# EAGLE design 232_compass (EAGLE 9.6.2)
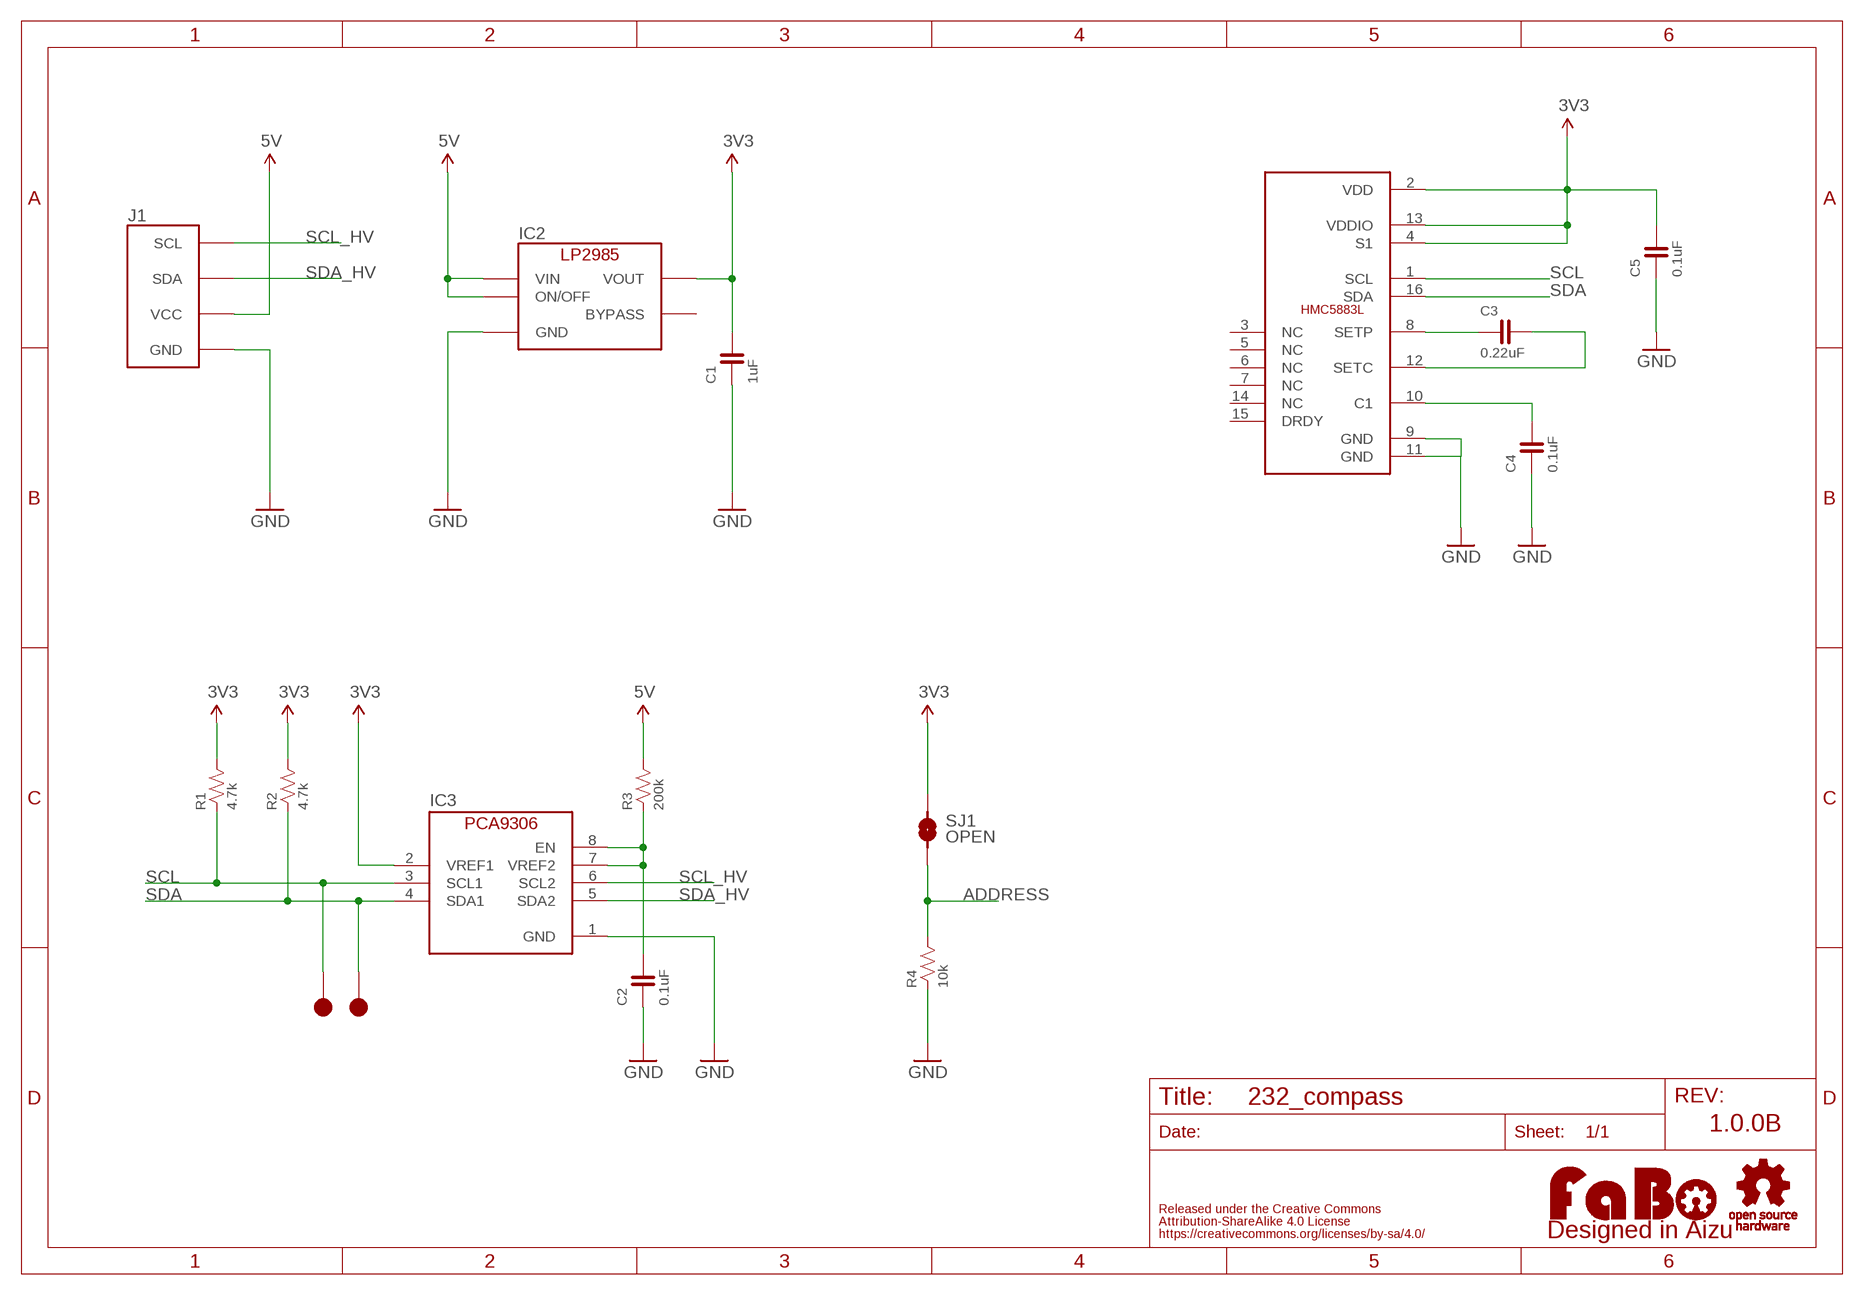
[diagram p0: schematic, sheet 1]

## Parts
C1  1uF  CAPACITOR-0603  [0603]
C2  0.1uF  CAPACITOR-0603  [0603]
C3  0.22uF  CAPACITOR-0603  [0603]
C4  0.1uF  CAPACITOR-0603  [0603]
C5  0.1uF  CAPACITOR-0603  [0603]
HMC5883L  HONEYWELL-HMC5883L  [HONEYWELL-HMC5883L]
IC2  LP2985-33DBV  [SOT-23-5]
IC3  PCA9306GM  [XQFN8]
J1  FABO_BRICK_I2C  [FABO_BRICK_I2C]
LOGO1  LOGO_FABO-M  [LOGO_FABO_M]
R1  4.7k  RESISTOR-0603  [0603]
R2  4.7k  RESISTOR-0603  [0603]
R3  200k  RESISTOR-0603  [0603]
R4  10k  RESISTOR-0603  [0603]
SJ1  OPEN  SMD-JUMPER-2  [SMD-JUMPER-2]
TP1  TP-15  [TP-15]
TP2  TP-15  [TP-15]
U$2  LOGO_OSHW-M_BOTTOM  [LOGO_OSHW_M_BOTTOM]

## Nets
3V3: C1.2 C5.2 HMC5883L.2(VDD) HMC5883L.4(S1) HMC5883L.13(VDDIO) IC2.5(VOUT) IC3.2(VREF1) R1.2 R2.2 SJ1.1
5V: IC2.1(VIN) IC2.3(ON/OFF) J1.VCC R3.2
ADDRESS: R4.2 SJ1.2
GND: C1.1 C2.1 C4.1 C5.1 HMC5883L.9(GND) HMC5883L.11(GND) IC2.2(GND) IC3.1(GND) J1.GND R4.1
N$1: C2.2 IC3.7(VREF2) IC3.8(EN) R3.1
N$2: C3.1 HMC5883L.8(SETP)
N$3: C3.2 HMC5883L.12(SETC)
N$4: C4.2 HMC5883L.10(C1)
SCL: HMC5883L.1(SCL) IC3.3(SCL1) R1.1 TP2.1
SCL_HV: IC3.6(SCL2) J1.SCL
SDA: HMC5883L.16(SDA) IC3.4(SDA1) R2.1 TP1.1
SDA_HV: IC3.5(SDA2) J1.SDA
Unconnected: HMC5883L.3(NC) HMC5883L.5(NC) HMC5883L.6(NC) HMC5883L.7(NC) HMC5883L.14(NC) HMC5883L.15(DRDY) IC2.4(BYPASS)

## Notes on the sheet
- 1.0.0B

## Library data of the parts
C1-C5 = FaBo-Capacitor:CAPACITOR: CAPACITOR
HMC5883L = FaBo-Axis:HONEYWELL-HMC5883L
IC2 = FaBo-Supply:LP2985: LP2985
IC3 = FaBo-LevelTranslator:PCA9306
J1 = FaBo-Template:FABO_BRICK_I2C: FaBo Brick I2C
LOGO1 = component:LOGO_FABO
R1-R4 = FaBo-Resistors:RESISTOR: RESISTOR
SJ1 = FaBo-etc:SMD-JUMPER-2
TP1 TP2 = FaBo-Supply:TP
U$2 = FaBo-etc:LOGO_OSHW

## Board
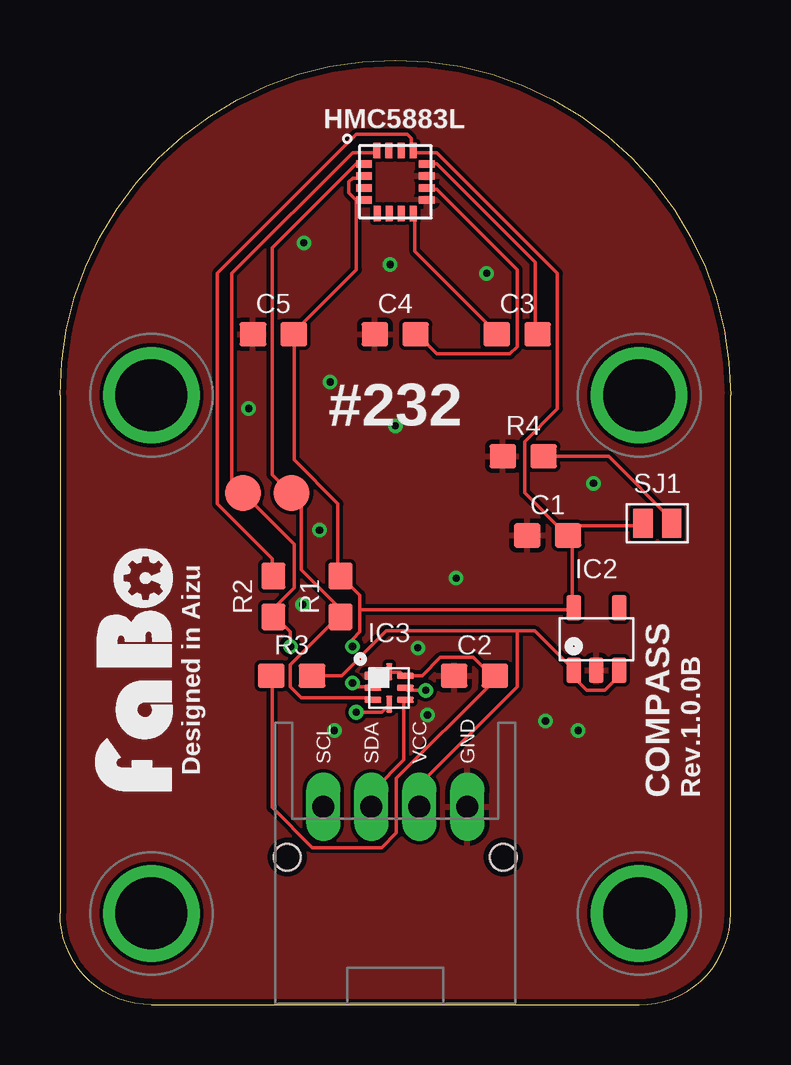
[diagram p1: board, top side]
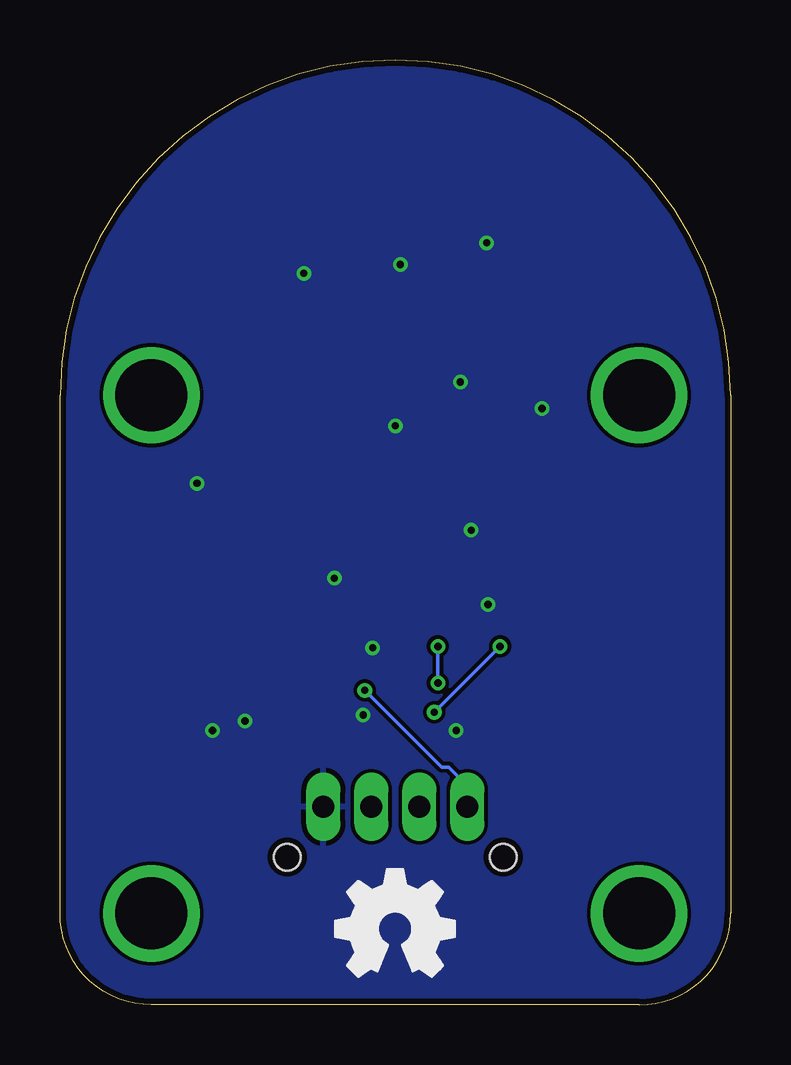
[diagram p2: board, bottom side, seen from below]

Size 27.94 x 39.37 mm. Coordinates in mm from the lower left corner, seen from the top.
Copper layers (1*16): Top 0.035mm / dielectric 1.6mm / Bottom 0.035mm
Design rules "PCBway": minimum track width 6mil, minimum drill 12mil, track to track 6mil, track to pad 6mil, pad to pad 6mil, via to via 6mil, smd to smd 6mil, copper to edge 10mil, drill to drill 10mil, minimum pad ring 10mil, minimum via ring 6mil, stop-mask expansion 2mil, vias tented up to drill 100mil, thermal gap 8mil

### Footprints (pad centres in the part's own frame; a part is rotated, then mirrored left to right if it is on the bottom)
0603 = smd 1.1 x 1: 1 -0.85,0; 2 0.85,0
HONEYWELL-HMC5883L = smd 0.65 x 0.3: 1 -1.31,0.75; 2 -1.31,0.25; 3 -1.31,-0.25; 4 -1.31,-0.75; 9 1.31,-0.75; 10 1.31,-0.25; 11 1.31,0.25; 12 1.31,0.75 | smd 0.3 x 0.65: 5 -0.75,-1.31; 6 -0.25,-1.31; 7 0.25,-1.31; 8 0.75,-1.31; 13 0.75,1.31; 14 0.25,1.31; 15 -0.27,1.31; 16 -0.77,1.31
SOT-23-5 = smd 0.6 x 1.05: 1 -0.95,-1.3; 2 0,-1.3; 3 0.95,-1.3; 4 0.95,1.3; 5 -0.95,1.3
XQFN8 = smd 0.7 x 0.35: 1 -0.675,0.5 | smd 0.7 x 0.25: 2 -0.675,0; 3 -0.675,-0.5; 5 0.675,-0.5; 6 0.675,0; 7 0.675,0.5 | smd 0.25 x 0.7: 4 0,-0.675; 8 0,0.675
FABO_BRICK_I2C = drill 0.9 pad 1.422 long: GND 3,-10.795; SCL -3,-10.795; SDA -1,-10.795; VCC 1,-10.795 | drill 3 pad 3.81: P$1 -10.16,6.35; P$2 10.16,6.35; P$3 -10.16,-15.24; P$4 10.16,-15.24 | hole 1.1: -4.5,-12.895; 4.5,-12.895
SMD-JUMPER-2 = smd 0.8 x 1.2: 1 -0.6,0; 2 0.6,0
TP-15 = smd 1.5 x 1.5: 1 0,0

### Placement (x,y rotation side)
C1  20.32,19.56 0 top
C2  17.27,13.72 0 top
C3  19.05,27.94 0 top
C4  13.97,27.94 0 top
C5  8.89,27.94 0 top
HMC5883L  13.97,34.29 0 top
IC2  22.35,15.24 0 top
IC3  13.72,13.21 0 top
J1  13.97,19.05 0 top
LOGO1  5.08,13.97 90 top
R1  11.68,17.02 90 top
R2  8.89,17.02 90 top
R3  9.65,13.72 0 top
R4  19.3,22.86 0 top
SJ1  24.89,20.07 0 top
TP1  7.62,21.34 0 top
TP2  9.65,21.34 0 top
U$2  13.97,3.17 0 top

### Tracks (layer width: path | path; a pad name or v marks a point on that pad's centre or on a via)
3V3  (via drill 0.3)
  Top 0.152: 12.34,33.53 12.65,33.53 HMC5883L.4 12.34,33.53 | 12.34,33.53 12.04,33.83 12.04,34.29 12.19,34.44 12.65,34.44 HMC5883L.2 | 12.34,33.53 12.34,30.63 9.75,28.04 C5.2 9.75,27.89 9.75,22.71 11.58,20.88 11.58,17.98 R1.2 11.73,17.83 12.5,17.07 12.5,16.46 | v12.19,13.41 12.34,13.26 12.95,13.26 IC3.2 | v12.19,14.94 12.19,15.24 12.5,15.54 12.5,16.46 | C1.2 21.03,19.66 19.36,21.34 19.36,23.47 20.73,24.84 20.73,30.48 15.7,35.51 14.78,35.51 HMC5883L.13 14.63,35.66 14.63,36.12 14.48,36.27 12.34,36.27 6.55,30.48 6.55,20.88 8.84,18.59 8.84,17.98 R2.2 | C1.2 21.18,19.51 21.34,19.36 21.34,16.61 IC2.5 21.34,16.46 12.5,16.46 | SJ1.1 24.23,19.96 21.49,19.96 21.18,19.66 C1.2
  Bottom 0.152: v12.19,14.94 v12.19,13.41
5V
  Top 0.152: IC2.3 23.16,13.87 23.16,13.56 22.71,13.11 21.95,13.11 21.49,13.56 21.49,13.87 IC2.1 21.34,14.02 19.77,15.58 19.05,15.58 | R3.2 11.73,13.72 13.6,15.58 19.05,15.58 | 19.05,15.58 19.05,13.26 15.09,9.3 15.09,8.38 J1.VCC
ADDRESS
  Top 0.152: R4.2 22.86,22.86 25.6,20.12 SJ1.2
GND  (via drill 0.3)
  other vias: 10.16,31.75 13.97,24.13 17.78,30.48 11.43,11.43 21.59,11.43 16.51,17.78 7.86,24.85 11.26,25.95 13.76,30.85 22.23,21.73 20.23,11.83 10.81,19.78 10.11,16.68 14.91,14.88 15.31,12.08
  pour Bottom: 0,0 27.94,0 27.94,39.37 0,39.37
  pour Top: 0,0 27.94,0 27.94,39.37 0,39.37
N$1
  Top 0.152: IC3.8 13.72,13.87 14.17,13.87 14.33,13.72 IC3.7 14.48,13.72 15.09,13.72 15.85,14.48 17.22,14.48 17.98,13.72 | 17.98,13.72 17.98,13.41 14.02,9.45 14.02,7.16 13.41,6.55 10.52,6.55 8.84,8.23 8.84,13.72 R3.1 | 17.98,13.72 C2.2
N$2
  Top 0.152: HMC5883L.8 14.78,32.92 14.78,31.39 18.14,28.04 C3.1
N$3
  Top 0.152: HMC5883L.12 15.39,35.05 15.7,35.05 19.81,30.94 19.81,28.04 C3.2
N$4
  Top 0.152: HMC5883L.10 15.39,33.98 15.7,33.98 19.05,30.63 19.05,27.43 18.75,27.13 15.7,27.13 14.94,27.89 C4.2
SCL
  Top 0.152: IC3.3 12.95,12.8 10.06,12.8 9.6,13.26 9.6,14.17 11.58,16.15 R1.1 11.58,16.31 11.58,16.61 10.06,18.14 10.06,21.03 9.75,21.34 TP2.1 9.6,21.34 8.84,22.1 8.84,31.55 12.34,35.05 12.65,35.05 HMC5883L.1
SCL_HV  (via drill 0.3)
  Top 0.152: v15.24,13.11 14.48,13.11 IC3.6
  Bottom 0.152: v15.24,13.11 12.04,9.91 11.73,9.91 10.97,9.14 10.97,8.38 J1.SCL
SDA  (via drill 0.3)
  Top 0.152: v12.34,12.19 13.41,12.19 13.72,12.5 IC3.4 | v9.6,14.94 9.6,15.54 8.99,16.15 R2.1 8.99,16.31 8.99,16.61 9.75,17.37 9.75,19.2 TP1.1 7.16,21.79 7.16,30.48 12.19,35.51 13.11,35.51 HMC5883L.16
  Bottom 0.152: v9.6,14.94 v12.34,12.19
SDA_HV
  Top 0.152: IC3.5 14.33,12.65 14.33,10.21 13.11,8.99 13.11,8.38 J1.SDA

### Text on the board
tPlace: #232 | Designed in Aizu | COMPASS | Rev.1.0.0B